# Altium schematic sheet Thermometers.SchDoc
size A4; DocumentNumber: 12; SheetNumber: 12; SheetTotal: 30
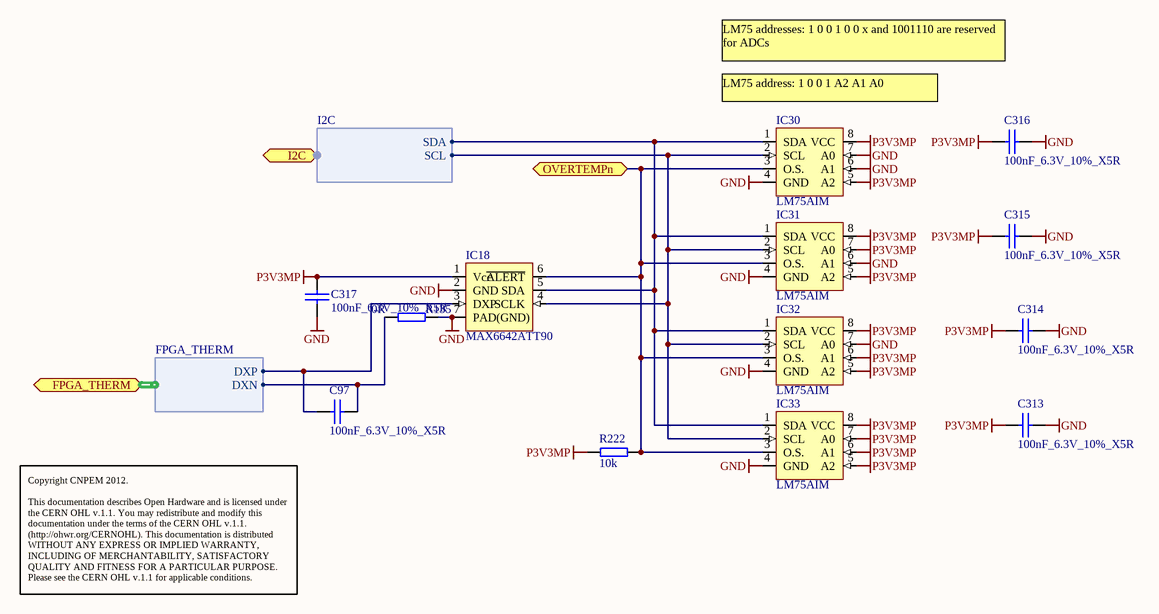
[diagram p0: Thermometers.SchDoc]

## Parts
C97  100nF_6.3V_10%_X5R  [0201C]
C313  100nF_6.3V_10%_X5R  [0201C]
C314  100nF_6.3V_10%_X5R  [0201C]
C315  100nF_6.3V_10%_X5R  [0201C]
C316  100nF_6.3V_10%_X5R  [0201C]
C317  100nF_6.3V_10%_X5R  [0201C]
IC18  MAX6642ATT90  [TFDN6]
IC30  LM75AIM  [SOIC127P600X175-8N]
IC31  LM75AIM  [SOIC127P600X175-8N]
IC32  LM75AIM  [SOIC127P600X175-8N]
IC33  LM75AIM  [SOIC127P600X175-8N]
R135  0R  [0402R]
R222  10k  [0402R]

## Ports
FPGA_THERM (harness FPGA_THERM), I2C (harness I2C), OVERTEMPn (bidir)

## Harnesses
FPGA_THERM: DXN, DXP
I2C: SCL, SDA

## Nets
GND: C313.2 C314.2 C315.2 C316.2 C317.2 IC18.2(GND) IC18.7(PAD(GND)) IC30.4(GND) IC30.6(A1) IC30.7(A0) IC31.4(GND) IC31.6(A1) IC32.4(GND) IC32.7(A0) IC33.4(GND) R135.2
P3V3MP: C313.1 C314.1 C315.1 C316.1 C317.1 IC18.1(Vcc) IC30.5(A2) IC30.8(VCC) IC31.5(A2) IC31.7(A0) IC31.8(VCC) IC32.5(A2) IC32.6(A1) IC32.8(VCC) IC33.5(A2) IC33.6(A1) IC33.7(A0) IC33.8(VCC) R222.1
OVERTEMPn: IC18.6(~{ALERT}) IC30.3(O.S.) IC31.3(O.S.) IC32.3(O.S.) IC33.3(O.S.) R222.2 ; port OVERTEMPn
NetC97_1: C97.1 IC18.3(DXP) ; port FPGA_THERM.DXP
NetC97_2: C97.2 R135.1 ; port FPGA_THERM.DXN
NetIC18_4: IC18.4(SCLK) IC30.2(SCL) IC31.2(SCL) IC32.2(SCL) IC33.2(SCL) ; port I2C.SCL
NetIC18_5: IC18.5(SDA) IC30.1(SDA) IC31.1(SDA) IC32.1(SDA) IC33.1(SDA) ; port I2C.SDA

## Notes on the sheet
- (near IC30) LM75 address: 1 0 0 1 A2 A1 A0
- LM75 addresses: 1 0 0 1 0 0 x and 1001110 are reserved for ADCs
- Copyright CNPEM 2012.
  This documentation describes Open Hardware and is licensed under the CERN OHL v.1.1. You may redistribute and modify this documentation under the terms of the CERN OHL v.1.1. (http://ohwr.org/CERNOHL). This documentation is distributed WITHOUT ANY EXPRESS OR IMPLIED WARRANTY, INCLUDING OF MERCHANTABILITY, SATISFACTORY QUALITY AND FITNESS FOR A PARTICULAR PURPOSE. Please see the CERN OHL v.1.1 for applicable conditions.

## Library data of the parts
C97 C313-C317 = CAP_SMD_0201: Capacitor SMD
IC18 = SENS_MAX6642: ±1°C, SMBus- Remote/Local Temperature Sensor with Overtemperature Alarm; Supplier 1: Digi-Key; Supplier Part Number 1: MAX6642ATT90+TCT-ND
IC30-IC33 = SENS_LM75: I2C temperature sensor
R135 = RES_0402: SMD Resistor; Supplier 1: Newark; Supplier Part Number 1: 59M6691
R222 = RES_SMD: SMD Resistor